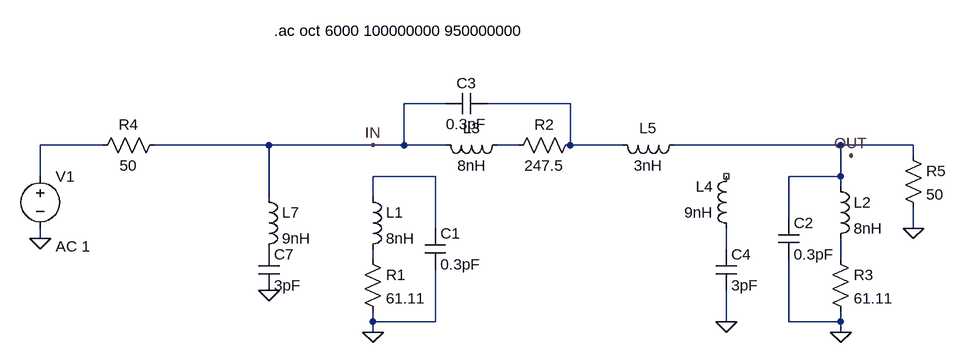
[diagram p0: schematic 20dB-UHF.asc]
20dB-UHF.asc, the LTspice schematic file:
Version 4
SHEET 1 1048 680
WIRE 256 16 192 16
WIRE 448 16 320 16
WIRE -272 80 -368 80
WIRE -16 80 -192 80
WIRE 144 80 -16 80
WIRE 192 80 192 16
WIRE 192 80 144 80
WIRE 256 80 192 80
WIRE 368 80 336 80
WIRE 448 80 448 16
WIRE 528 80 448 80
WIRE 864 80 608 80
WIRE 976 80 864 80
WIRE 976 96 976 80
WIRE -368 128 -368 80
WIRE 240 128 144 128
WIRE 864 128 864 80
WIRE 864 128 784 128
WIRE 864 144 864 128
WIRE -16 160 -16 80
WIRE 144 160 144 128
WIRE 784 192 784 128
WIRE 240 208 240 128
WIRE 976 208 976 176
WIRE -368 224 -368 208
WIRE 688 240 688 208
WIRE 144 256 144 240
WIRE 864 256 864 224
WIRE 144 352 144 336
WIRE 240 352 240 272
WIRE 240 352 144 352
WIRE 688 352 688 304
WIRE 784 352 784 256
WIRE 864 352 864 336
WIRE 864 352 784 352
WIRE 144 368 144 352
WIRE 864 368 864 352
FLAG 144 368 0
FLAG 864 368 0
FLAG 976 208 0
FLAG -368 224 0
FLAG 144 80 IN
FLAG 880 96 OUT
FLAG 688 352 0
FLAG -16 304 0
SYMBOL res 128 240 R0
SYMATTR InstName R1
SYMATTR Value 61.11
SYMATTR SpiceLine tol=1 pwr=0.1
SYMBOL res 464 64 R90
WINDOW 0 0 56 VBottom 2
WINDOW 3 32 56 VTop 2
SYMATTR InstName R2
SYMATTR Value 247.5
SYMATTR SpiceLine tol=1 pwr=0.1
SYMBOL res 848 240 R0
SYMATTR InstName R3
SYMATTR Value 61.11
SYMATTR SpiceLine tol=1 pwr=0.1
SYMBOL res -176 64 R90
WINDOW 0 0 56 VBottom 2
WINDOW 3 32 56 VTop 2
SYMATTR InstName R4
SYMATTR Value 50
SYMATTR SpiceLine tol=1 pwr=0.1
SYMBOL res 960 80 R0
SYMATTR InstName R5
SYMATTR Value 50
SYMATTR SpiceLine tol=1 pwr=0.1
SYMBOL voltage -368 112 R0
WINDOW 123 24 124 Left 2
WINDOW 39 0 0 Left 2
SYMATTR Value2 AC 1
SYMATTR InstName V1
SYMATTR Value ""
SYMBOL ind 128 144 R0
SYMATTR InstName L1
SYMATTR Value 8nH
SYMATTR SpiceLine Ipk=0.39 Rser=0.47 Rpar=170 Cpar=0
SYMBOL ind 848 128 R0
SYMATTR InstName L2
SYMATTR Value 8nH
SYMBOL ind 240 64 M90
WINDOW 0 5 56 VBottom 2
WINDOW 3 32 56 VTop 2
SYMATTR InstName L3
SYMATTR Value 8nH
SYMBOL cap 224 208 R0
SYMATTR InstName C1
SYMATTR Value 0.3pF
SYMBOL cap 768 192 R0
SYMATTR InstName C2
SYMATTR Value 0.3pF
SYMBOL cap 320 0 R90
WINDOW 0 0 32 VBottom 2
WINDOW 3 32 32 VTop 2
SYMATTR InstName C3
SYMATTR Value 0.3pF
SYMBOL ind 704 224 R180
WINDOW 0 36 80 Left 2
WINDOW 3 36 40 Left 2
SYMATTR InstName L4
SYMATTR Value 9nH
SYMBOL cap 672 240 R0
SYMATTR InstName C4
SYMATTR Value 3pF
SYMBOL ind -32 144 R0
SYMATTR InstName L7
SYMATTR Value 9nH
SYMBOL cap -32 240 R0
SYMATTR InstName C7
SYMATTR Value 3pF
SYMBOL ind 624 64 R90
WINDOW 0 5 56 VBottom 2
WINDOW 3 32 56 VTop 2
SYMATTR InstName L5
SYMATTR Value 3nH
TEXT -8 -96 Left 2 !.ac oct 6000 100000000 950000000

The netlist it stands for:
* 20dB-UHF.asc
R1 N007 0 61.11 tol=1 pwr=0.1
R2 N001 N003 247.5 tol=1 pwr=0.1
R3 N008 0 61.11 tol=1 pwr=0.1
R4 IN N002 50 tol=1 pwr=0.1
R5 N004 0 50 tol=1 pwr=0.1
V1 N002 0 AC 1
L1 N005 N007 8nH Ipk=0.39 Rser=0.47 Rpar=170 Cpar=0
L2 N004 N008 8nH
L3 IN N003 8nH
C1 N005 0 0.3pF
C2 N004 0 0.3pF
C3 N001 IN 0.3pF
L4 N006 NC_01 9nH
C4 N006 0 3pF
L7 IN P001 9nH
C7 P001 0 3pF
L5 N004 N001 3nH
.ac oct 6000 100000000 950000000
.backanno
.end